# EAGLE design BrewPi Shield (EAGLE 9.4.2)
COMPANY: BrewPi Remix; ENGINEER: @LBussy; MANAGER: @Cadibrewer; REVIEW: @day_trippr; SCH_REV: 1.3.1a; WEBSITE: https://www.brewpiremix.com
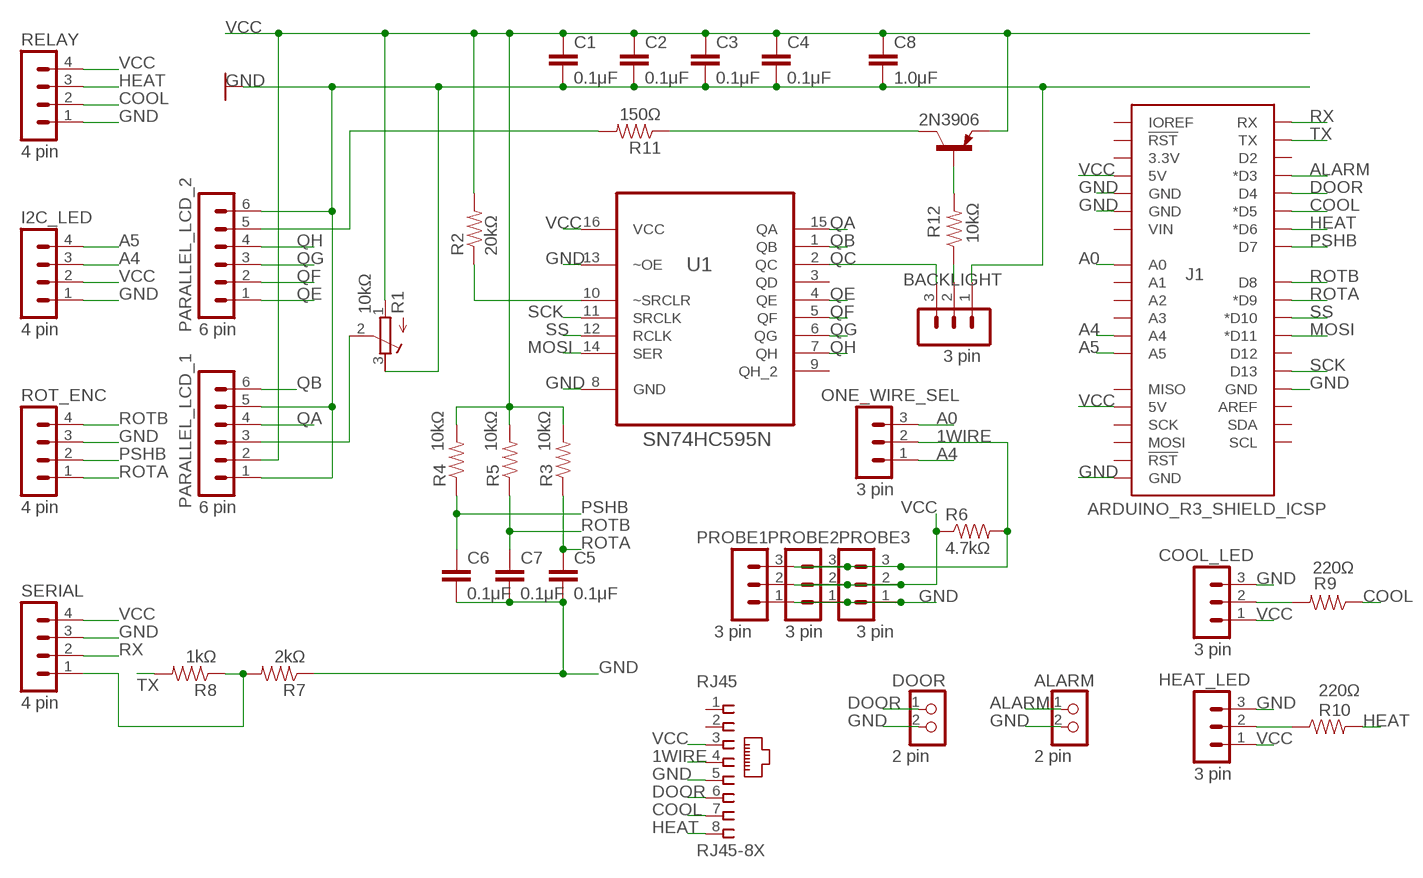
[diagram p0: schematic, sheet 1]

## Parts
ALARM  2 pin  HEADER02-1  [HEADER02-1]
BACKLIGHT  3 pin  HEADER03-1  [HEADER03-1]
C1  0.1μF  CAPKIT  [CAP-PTH-SMALL-KIT]
C2  0.1μF  CAPKIT  [CAP-PTH-SMALL-KIT]
C3  0.1μF  CAPKIT  [CAP-PTH-SMALL-KIT]
C4  0.1μF  CAPKIT  [CAP-PTH-SMALL-KIT]
C5  0.1μF  CAPKIT  [CAP-PTH-SMALL-KIT]
C6  0.1μF  CAPKIT  [CAP-PTH-SMALL-KIT]
C7  0.1μF  CAPKIT  [CAP-PTH-SMALL-KIT]
C8  1.0μF  CAPKIT  [CAP-PTH-SMALL-KIT]
COOL_LED  3 pin  HEADER03-1  [HEADER03-1]
DOOR  2 pin  HEADER02-1  [HEADER02-1]
HEAT_LED  3 pin  HEADER03-1  [HEADER03-1]
I2C_LED  4 pin  HEADER04-1  [HEADER04-1]
J1  ARDUINO_R3_SHIELD_ICSP  [UNO_R3_SHIELD_ICSP]
ONE_WIRE_SEL  3 pin  HEADER03-1  [HEADER03-1]
PARALLEL_LCD_1  6 pin  HEADER06-1  [HEADER06-1]
PARALLEL_LCD_2  6 pin  HEADER06-1  [HEADER06-1]
PROBE1  3 pin  HEADER03-1  [HEADER03-1]
PROBE2  3 pin  HEADER03-1  [HEADER03-1]
PROBE3  3 pin  HEADER03-1  [HEADER03-1]
Q1  2N3906  [TO92]
R1  10kΩ  R-TRIMM3296Y  [RTRIM3296Y]
R2  20kΩ  RESISTORAXIAL-0.3  [AXIAL-0.3]
R3  10kΩ  RESISTORAXIAL-0.3  [AXIAL-0.3]
R4  10kΩ  RESISTORAXIAL-0.3  [AXIAL-0.3]
R5  10kΩ  RESISTORAXIAL-0.3  [AXIAL-0.3]
R6  4.7kΩ  RESISTORAXIAL-0.3  [AXIAL-0.3]
R7  2kΩ  RESISTORAXIAL-0.3  [AXIAL-0.3]
R8  1kΩ  RESISTORAXIAL-0.3  [AXIAL-0.3]
R9  220Ω  RESISTORAXIAL-0.3  [AXIAL-0.3]
R10  220Ω  RESISTORAXIAL-0.3  [AXIAL-0.3]
R11  150Ω  RESISTORAXIAL-0.3  [AXIAL-0.3]
R12  10kΩ  RESISTORAXIAL-0.3  [AXIAL-0.3]
RELAY  4 pin  HEADER04-1  [HEADER04-1]
RJ45  RJ45-8X  [RJ45-NO-SHIELD]
ROT_ENC  4 pin  HEADER04-1  [HEADER04-1]
SERIAL  4 pin  HEADER04-1  [HEADER04-1]
U1  SN74HC595N  [DIP254P762X508-16]

## Nets
1WIRE: ONE_WIRE_SEL.2 PROBE1.3 PROBE2.3 PROBE3.3 R6.P$2 RJ45.4
A0: J1.A0 ONE_WIRE_SEL.3
A4: I2C_LED.3 J1.A4 ONE_WIRE_SEL.1
A5: I2C_LED.4 J1.A5
ALARM: ALARM.1 J1.D3(*D3)
COOL: J1.D5(*D5) R9.P$1 RELAY.2 RJ45.7
DOOR: DOOR.1 J1.D4 RJ45.6
GND: ALARM.2 BACKLIGHT.1 C1.2 C2.2 C3.2 C4.2 C5.2 C6.2 C7.2 C8.2 COOL_LED.3 DOOR.2 HEAT_LED.3 I2C_LED.1 J1.GND@0(GND) J1.GND@1(GND) J1.GND@2(GND) J1.GND_ICSP(GND) PARALLEL_LCD_1.1 PARALLEL_LCD_1.5 PARALLEL_LCD_2.6 PROBE1.1 PROBE2.1 PROBE3.1 R1.3(E) R7.P$1 RELAY.1 RJ45.5 ROT_ENC.3 SERIAL.3 U1.8(GND) U1.13(~OE)
HEAT: J1.D6(*D6) R10.P$2 RELAY.3 RJ45.8
MOSI: J1.D11(*D11) U1.14(SER)
N$1: R2.P$1 U1.10(~SRCLR)
N$2: BACKLIGHT.2 R12.P$1
N$3: R7.P$2 R8.P$1 SERIAL.1
N$4: COOL_LED.2 R9.P$2
N$5: PARALLEL_LCD_2.5 R11.P$2
N$6: PARALLEL_LCD_1.3 R1.2(S)
N$7: Q1.1(C) R11.P$1
N$8: HEAT_LED.2 R10.P$1
N$9: Q1.2(B) R12.P$2
PSHB: C6.1 J1.D7 R4.P$1 ROT_ENC.2
QA: PARALLEL_LCD_1.4 U1.15(QA)
QB: PARALLEL_LCD_1.6 U1.1(QB)
QC: BACKLIGHT.3 U1.2(QC)
QE: PARALLEL_LCD_2.1 U1.4(QE)
QF: PARALLEL_LCD_2.2 U1.5(QF)
QG: PARALLEL_LCD_2.3 U1.6(QG)
QH: PARALLEL_LCD_2.4 U1.7(QH)
ROTA: C5.1 J1.D9(*D9) R3.P$1 ROT_ENC.1
ROTB: C7.1 J1.D8 R5.P$1 ROT_ENC.4
RX: J1.RX SERIAL.2
SCK: J1.D13 U1.11(SRCLK)
SS: J1.D10(*D10) U1.12(RCLK)
TX: J1.TX R8.P$2
VCC: C1.1 C2.1 C3.1 C4.1 C8.1 COOL_LED.1 HEAT_LED.1 I2C_LED.2 J1.5V J1.5V_ICSP(5V) PARALLEL_LCD_1.2 PROBE1.2 PROBE2.2 PROBE3.2 Q1.3(E) R1.1(A) R2.P$2 R3.P$2 R4.P$2 R5.P$2 R6.P$1 RELAY.4 RJ45.3 SERIAL.4 U1.16(VCC)
Unconnected: J1.3.3V J1.A1 J1.A2 J1.A3 J1.AREF J1.D2 J1.D12 J1.IOREF J1.MISO J1.MOSI J1.RES(!RST!) J1.RST_ICSP(!RST!) J1.SCK J1.SCL J1.SDA J1.VIN RJ45.1 RJ45.2 U1.3(QD) U1.9(QH_2)

## Library data of the parts
ALARM DOOR = LBussy:HEADER02-1: PIN HEADER
BACKLIGHT COOL_LED HEAT_LED ONE_WIRE_SEL PROBE1-PROBE3 = LBussy:HEADER03-1: PIN HEADER; OC_FARNELL: unknown; OC_NEWARK: unknown
C1-C8 = SparkFun-Capacitors:CAP: Capacitor Standard 0603 ceramic capacitor, and 0.1" leaded capacitor.
I2C_LED RELAY ROT_ENC SERIAL = LBussy:HEADER04-1: PIN HEADER; OC_FARNELL: unknown; OC_NEWARK: unknown
J1 = SparkFun-Boards:ARDUINO_R3_SHIELD_ICSP: Arduino R3 Shield Footprint w/ 6-pin (2x3) ICSP Header
PARALLEL_LCD_1 PARALLEL_LCD_2 = LBussy:HEADER06-1: PIN HEADER; OC_FARNELL: unknown; OC_NEWARK: unknown
Q1 = transistor-pnp:2N3906: PNP Transistor
R1 = rcl:R-TRIMM: Trimm resistor; SPICEMODEL: X; SPICEPREFIXL: POT
R2-R12 = SparkFun-Passives:RESISTOR: Resistor Basic schematic elements and footprints for 0603, 1206, and PTH resistors.
RJ45 = con-tycoelectronics:RJ45: CORCOM Modular RJ Jacks No Shield Source: www.tycoelectronics.com .. ENG_DS_1654001_1099_RJ_L_0507.pdf; MPN: RJ45-8X; OC_FARNELL: unknown; OC_NEWARK: 16R6101
U1 = Texas Instruments_By_element14_Batch_1:SN74HC595N: 8-BIT SHIFT REGISTERS WITH 3-STATE OUTPUT REGISTERS; MPN: SN74HC595N; OC_FARNELL: 9591664; OC_NEWARK: 60K6845; PACKAGE: PDIP-16; SUPPLIER: Texas Instruments

## Board
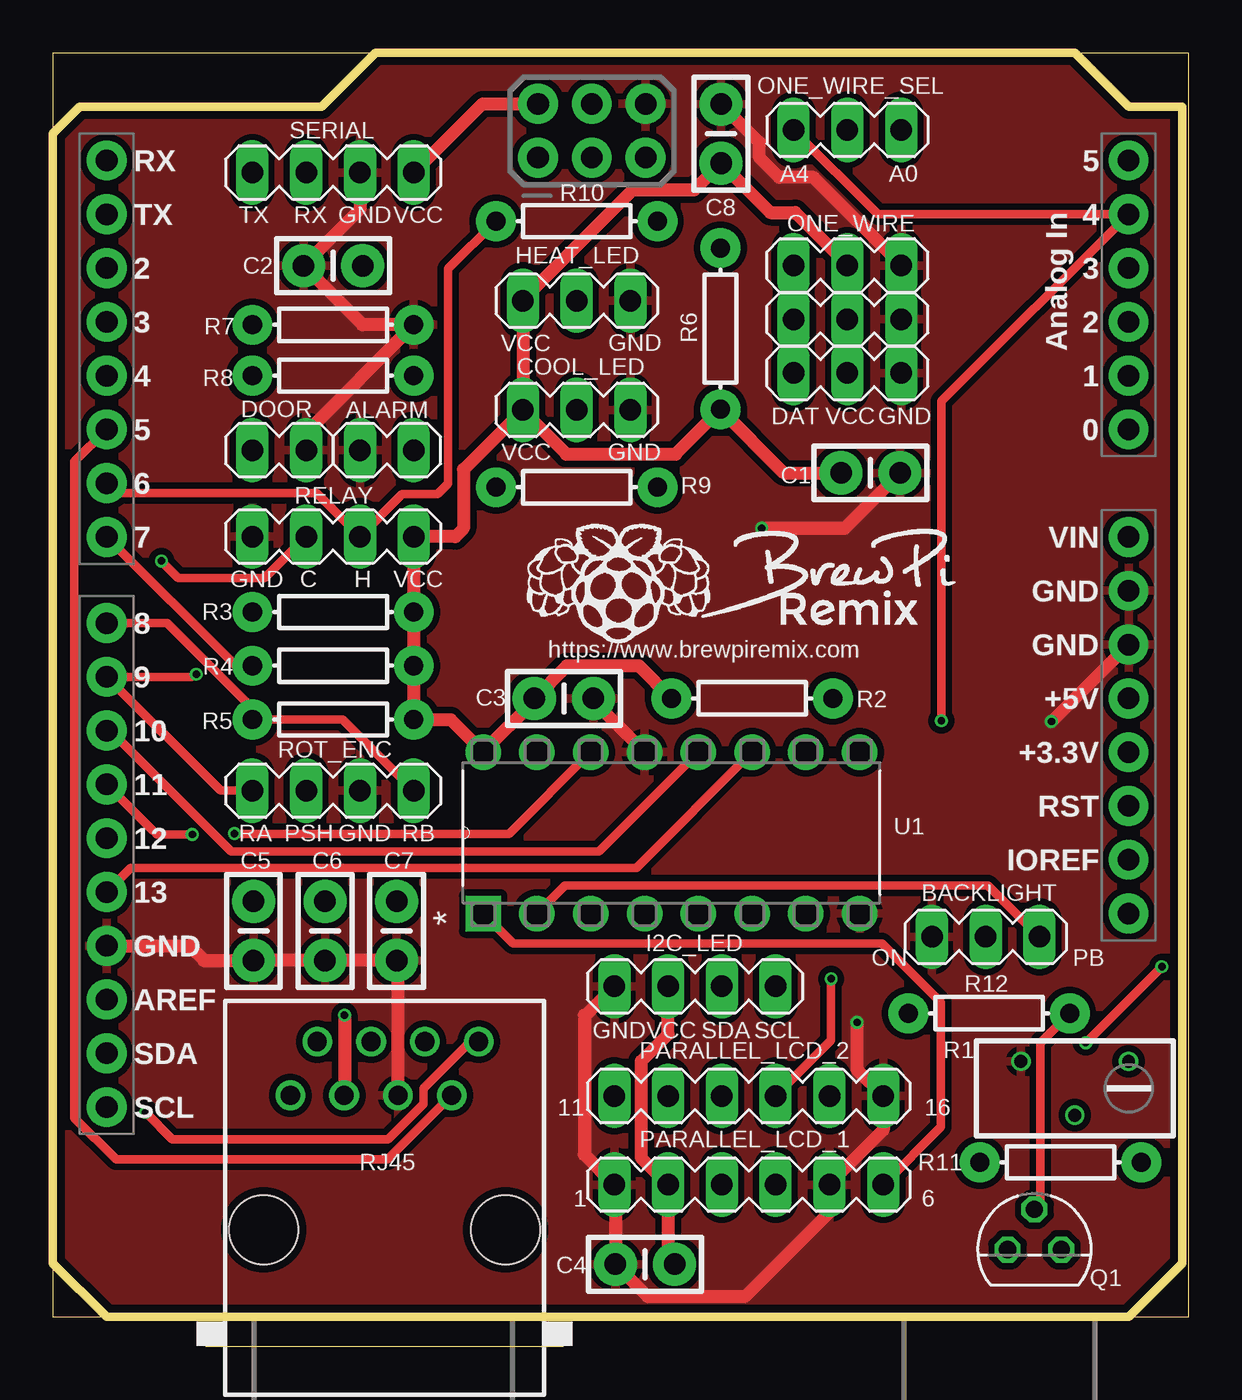
[diagram p1: board, top side]
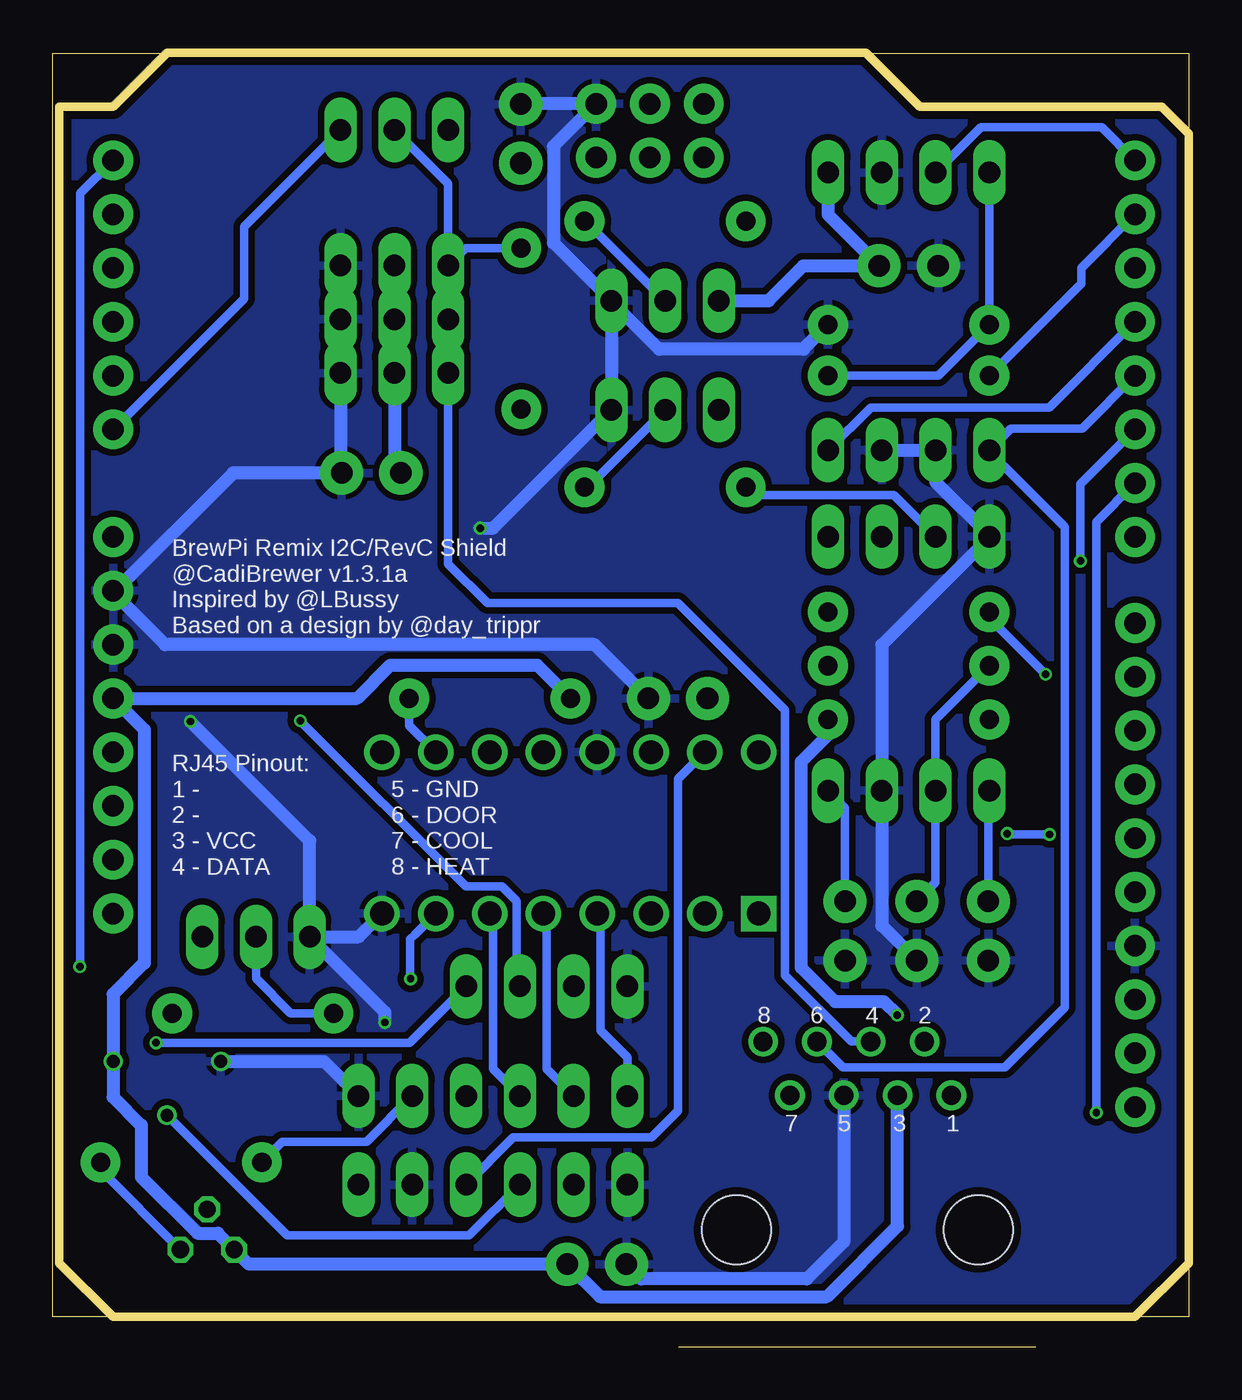
[diagram p2: board, bottom side, seen from below]

Size 53.65 x 59.69 mm. Coordinates in mm from the lower left corner, seen from the top.
Outline: 0,0 53.65,0 53.65,59.68 0,59.68 0,0
Outline: 0,2.54 0,55.88 1.27,57.15 12.7,57.15 15.24,59.69 48.26,59.69 50.8,57.15 53.34,57.15 53.34,2.54 50.8,0 2.54,0 0,2.54
Copper layers (1*16): Top 0.035559375mm / dielectric 1.6mm / Bottom 0.035559375mm
Design rules "oshpark-2layer *": minimum track width 6mil, minimum drill 10mil, track to track 8mil, track to pad 8mil, pad to pad 8mil, via to via 8mil, smd to smd 8mil, copper to edge 15mil, drill to drill 6mil, minimum pad ring 5mil, minimum via ring 5mil, stop-mask expansion 0mil, vias tented up to drill 3.5mm, thermal gap 10mil

### Footprints (pad centres in the part's own frame; a part is rotated, then mirrored left to right if it is on the bottom)
HEADER02-1 = drill 1.016 long: 1 -1.27,0; 2 1.27,0
HEADER03-1 = drill 1.016 long: 1 -2.54,0; 2 0,0; 3 2.54,0
CAP-PTH-SMALL-KIT = drill 1.016 pad 2.032: 1 -1.397,0; 2 1.397,0
HEADER04-1 = drill 1.016 long: 1 -3.81,0; 2 -1.27,0; 3 1.27,0; 4 3.81,0
UNO_R3_SHIELD_ICSP = drill 1.016 pad 1.88: 3.3V 50.8,26.67; 5V 50.8,29.21; 5V_ICSP 22.91,57.29; A0 50.8,41.91; A1 50.8,44.45; A2 50.8,46.99; A3 50.8,49.53; A4 50.8,52.07; A5 50.8,54.61; AREF 2.54,14.986; D2 2.54,49.53; D3 2.54,46.99; D4 2.54,44.45; D5 2.54,41.91; D6 2.54,39.37; D7 2.54,36.83; D8 2.54,32.766; D9 2.54,30.226; D10 2.54,27.686; D11 2.54,25.146; D12 2.54,22.606; D13 2.54,20.066; GND@0 50.8,31.75; GND@1 50.8,34.29; GND@2 2.54,17.526; GND_ICSP 27.99,57.29; IOREF 50.8,21.59; MISO 22.91,54.75; MOSI 25.45,57.29; NC 50.8,19.05; RES 50.8,24.13; RST_ICSP 27.99,54.75; RX 2.54,54.61; SCK 25.45,54.75; SCL 2.54,9.906; SDA 2.54,12.446; TX 2.54,52.07; VIN 50.8,36.83
HEADER06-1 = drill 1.016 long: 1 -6.35,0; 2 -3.81,0; 3 -1.27,0; 4 1.27,0; 5 3.81,0; 6 6.35,0
TO92 = drill 0.813 octagon: 1 1.27,0; 2 0,1.905; 3 -1.27,0
RTRIM3296Y = drill 0.61: 1 1.27,-2.54; 2 -1.27,0; 3 1.27,2.54
AXIAL-0.3 = drill 0.9 pad 1.88: P$1 -3.81,0; P$2 3.81,0
RJ45-NO-SHIELD = drill 0.9 pad 1.4: 1 -4.445,6.35; 2 -3.175,8.89; 3 -1.905,6.35; 4 -0.635,8.89; 5 0.635,6.35; 6 1.905,8.89; 7 3.175,6.35; 8 4.445,8.89 | hole 3.251: -5.715,0; 5.715,0
DIP254P762X508-16 = drill 1.118 square: 1 -7.62,17.78 | drill 1.118: 2 -7.62,15.24; 3 -7.62,12.7; 4 -7.62,10.16; 5 -7.62,7.62; 6 -7.62,5.08; 7 -7.62,2.54; 8 -7.62,0; 9 0,0; 10 0,2.54; 11 0,5.08; 12 0,7.62; 13 0,10.16; 14 0,12.7; 15 0,15.24; 16 0,17.78

### Placement (x,y rotation side)
ALARM  15.77,40.93 180 top
BACKLIGHT  44.06,17.95 0 top
C1  38.61,39.86 0 top
C2  13.23,49.64 180 top
C3  24.13,29.21 0 top
C4  27.96,2.49 180 top
C5  9.47,18.23 270 top
C6  12.85,18.23 270 top
C7  16.23,18.23 270 top
C8  31.55,55.88 90 top
COOL_LED  24.74,42.83 0 top
DOOR  10.69,40.93 0 top
HEAT_LED  24.74,47.99 0 top
I2C_LED  30.32,15.61 0 top
J1  0,0 0 top
ONE_WIRE_SEL  37.52,56.05 0 top
PARALLEL_LCD_1  32.86,6.25 0 top
PARALLEL_LCD_2  32.86,10.43 0 top
PROBE1  37.52,49.65 180 top
PROBE2  37.52,47.11 180 top
PROBE3  37.52,44.57 180 top
Q1  46.36,3.18 0 top
R1  48.26,10.79 90 top
R2  33.02,29.21 180 top
R3  13.23,33.29 0 top
R4  13.23,30.75 0 top
R5  13.23,28.21 0 top
R6  31.53,46.67 90 top
R7  13.23,46.85 180 top
R8  13.23,44.45 180 top
R9  24.74,39.18 0 top
R10  24.74,51.75 180 top
R11  47.59,7.3 180 top
R12  44.21,14.34 0 top
RELAY  13.23,36.85 0 top
RJ45  15.66,4.11 0 top
ROT_ENC  13.23,24.85 0 top
SERIAL  13.23,54.04 0 top
U1  38.1,26.67 90 top

### Tracks (layer width: path | path; a pad name or v marks a point on that pad's centre or on a via)
1WIRE
  Bottom 0.406: RJ45.4 15.94,13 19.07,16.13 19.07,28.65 24.13,33.71 33.13,33.71 34.98,35.56 PROBE3.3 PROBE2.3 PROBE1.3 | R6.P$2 34.15,50.48 PROBE1.3 | ONE_WIRE_SEL.2 34.98,53.51 PROBE1.3
A0
  Bottom 0.406: ONE_WIRE_SEL.3 44.62,51.49 44.62,48.09 J1.A0
A4  (via drill 0.35)
  Top 0.406: ONE_WIRE_SEL.1 38.96,52.07 J1.A4 41.97,43.24 v41.97,28.16 v41.96,28.15
  Bottom 0.406: v41.96,28.15 34.13,20.32 32.43,20.32 31.75,19.64 31.75,15.76 I2C_LED.3
A5  (via drill 0.35)
  Top 0.152: v52.37,16.54 v52.38,16.54
  Top 0.406: v48.78,12.95 v52.37,16.54
  Bottom 0.152: v52.38,16.54 52.35,16.56
  Bottom 0.406: J1.A5 52.35,53.06 52.35,17.93 52.35,16.56 | v48.78,12.95 36.8,12.95 I2C_LED.4
ALARM
  Bottom 0.406: J1.D3 6.58,42.95 15.02,42.95 ALARM.1
COOL  (via drill 0.35)
  Top 0.406: v5.12,35.7 5.92,34.9 10.01,34.9 RELAY.2 | RJ45.7 15.8,7.43 3,7.43 1.02,9.41 1.02,40.39 J1.D5
  Bottom 0.406: R9.P$1 20.55,38.81 13.92,38.81 RELAY.2 | J1.D5 5.12,39.33 v5.12,35.7
DOOR
  Bottom 0.406: RJ45.6 16.34,11.77 8.7,11.77 5.86,14.61 5.86,37.29 9.42,40.85 DOOR.1 8.4,41.95 5.04,41.95 J1.D4
GND  (via drill 0.35)
  Top 0.152: 25.15,14.25 25.1,14.25 | PARALLEL_LCD_1.1 26.56,6.2 | v47.16,28.12 v47.17,28.12
  Top 0.61: SERIAL.3 14.5,52.31 C2.2 14.62,46.85 R7.P$1 11.96,41.77 DOOR.2 | J1.GND@2 6.44,17.53 7.13,16.83 C5.2 C6.2 C7.2 16.29,16.77 RJ45.5 | PROBE1.1 40.06,49.69 35.93,53.82 34.3,53.82 33.37,54.75 33.37,55.46 C8.2 | v33.47,37.25 37.4,37.25 C1.2 | U1.13 25.53,29.08 C3.2 | I2C_LED.1 25.15,14.25 | 25.1,14.25 25.1,7.66 PARALLEL_LCD_1.1 | 26.56,6.2 C4.2 28.1,0.95 32.68,0.95 36.67,4.95 PARALLEL_LCD_1.5 36.67,6.29 39.21,8.83 PARALLEL_LCD_2.6 37.97,11.67 v37.97,13.91 | J1.GND@0 v47.17,28.12
  Bottom 0.152: R7.P$1 | 47.12,28.08 v47.16,28.12
  Bottom 0.61: 50.8,34.2 J1.GND@1 | PARALLEL_LCD_2.6 40.84,12.06 R1.3 | 50.8,34.2 45.14,39.86 C1.2 40.06,39.91 PROBE3.1 PROBE2.1 PROBE1.1 | ALARM.2 DOOR.2 11.96,39.43 9.42,36.89 RELAY.1 9.42,36.81 14.5,31.73 ROT_ENC.3 14.5,18.48 C6.2 | COOL_LED.3 | COOL_LED.3 32.87,37.25 v33.47,37.25 | HEAT_LED.3 30,50.72 30,55.28 J1.GND_ICSP 31.54,57.29 C8.2 | HEAT_LED.3 27.28,42.84 COOL_LED.3 | C3.2 28.07,31.75 48.35,31.75 50.8,34.2 | BACKLIGHT.1 39.2,17.94 U1.8 | R7.P$1 18.19,45.69 25.01,45.69 27.28,47.95 HEAT_LED.3 | BACKLIGHT.1 41.52,22.48 47.12,28.08 | RJ45.5 16.29,3.54 18.05,1.79 25.86,1.79 C4.2 | BACKLIGHT.1 37.97,14.4 v37.97,13.91
  pour Top (isolate 0.305): 0,2.54 0,55.88 1.27,57.15 12.7,57.15 15.24,59.69 48.26,59.69 50.8,57.15 53.34,57.15 53.34,2.54 50.8,0 2.54,0
  pour Bottom (isolate 0.305): 0,2.54 0,55.88 1.27,57.15 12.7,57.15 15.24,59.69 48.26,59.69 50.8,57.15 53.34,57.15 53.34,2.54 50.8,0 2.54,0
HEAT  (via drill 0.35)
  Top 0.406: J1.D6 3.01,38.9 12.45,38.9 RELAY.3 16.5,38.85 18.17,38.85 18.67,39.35 18.67,49.5 R10.P$2 | v4.37,9.65 5.64,8.38 15.84,8.38 17.51,10.06 17.51,10.78 19.73,13 RJ45.8
  Bottom 0.406: J1.D6 4.37,37.54 v4.37,9.65
MOSI  (via drill 0.35)
  Top 0.152: 4.77,22.91 4.74,22.95 | 8.59,22.81 v8.57,22.82
  Top 0.406: J1.D11 4.74,22.95 | U1.14 21.54,22.81 8.59,22.81 | 4.77,22.91 4.9,22.78 v6.58,22.78
  Bottom 0.152: 8.56,22.78 8.57,22.8 v8.57,22.82
  Bottom 0.406: v6.58,22.78 8.56,22.78
N$1
  Bottom 0.406: R2.P$1 36.83,27.94 U1.10
N$2
  Bottom 0.406: R12.P$1 42.42,14.34 44.06,15.98 BACKLIGHT.2
N$3
  Bottom 0.406: SERIAL.1 R7.P$2 11.82,44.45 R8.P$1
N$4
  Bottom 0.406: COOL_LED.2 28.39,39.18 R9.P$2
N$5
  Bottom 0.406: PARALLEL_LCD_2.5 38.84,8.27 42.81,8.27 R11.P$2
N$6
  Bottom 0.406: R1.2 42.58,3.85 33.99,3.85 PARALLEL_LCD_1.3
N$7
  Bottom 0.406: R11.P$1 51.4,6.95 Q1.1
N$8
  Bottom 0.406: R10.P$1 28.5,51.75 HEAT_LED.2
N$9
  Top 0.406: Q1.2 46.62,5.35 46.62,12.65 46.62,12.94 R12.P$2
PSHB
  Top 0.406: R4.P$1 8.62,30.75 J1.D7
  Bottom 0.406: C6.1 11.96,20.52 ROT_ENC.2 11.96,28.21 R4.P$1
QA
  Bottom 0.406: U1.15 24.13,25.4 24.13,9.73 25.38,8.47 31.91,8.47 PARALLEL_LCD_1.4
QB
  Top 0.406: PARALLEL_LCD_1.6 41.94,8.97 41.94,14.86 39.15,17.65 21.72,17.65 U1.1
QC
  Top 0.406: U1.2 24.19,20.38 38.12,20.38 44.16,20.38 BACKLIGHT.3
QE
  Bottom 0.406: PARALLEL_LCD_2.1 26.51,12.25 27.79,13.53 27.79,18.9 U1.4
QF
  Bottom 0.406: U1.5 30.33,18.9 30.33,11.71 PARALLEL_LCD_2.2
QG
  Bottom 0.406: U1.6 32.87,18.9 32.87,11.71 PARALLEL_LCD_2.3
QH  (via drill 0.35)
  Top 0.406: PARALLEL_LCD_2.4 36.75,13.05 v36.75,15.96
  Bottom 0.152: 36.77,15.98 v36.75,15.96
  Bottom 0.406: U1.7 36.56,18.05 36.57,18.05 36.77,17.85 36.77,15.98
ROTA  (via drill 0.35)
  Top 0.406: ROT_ENC.1 7.92,24.85 J1.D9 6.55,30.23 6.67,30.35 v6.77,30.35
  Bottom 0.406: ROT_ENC.1 9.47,24.8 C5.1 | v6.77,30.35 9.42,33 R3.P$1
ROTB
  Top 0.406: ROT_ENC.4 13.68,28.21 R5.P$1 9.42,28.75 5.4,32.77 J1.D8
  Bottom 0.406: ROT_ENC.4 16.23,24.04 C7.1
RX
  Bottom 0.406: J1.RX 4.12,56.19 9.81,56.19 SERIAL.2
SCK
  Top 0.406: J1.D13 3.68,21.21 27.56,21.21 U1.11
SS
  Top 0.406: J1.D10 2.71,27.69 8.42,21.97 25.79,21.97 U1.12
TX
  Bottom 0.406: J1.TX 5.08,49.53 5.08,48.79 R8.P$2
VCC  (via drill 0.35)
  Top 0.61: COOL_LED.1 HEAT_LED.1 22.2,48.03 27.39,53.23 30.29,53.23 C8.1 33.88,52.15 35.06,52.15 37.52,49.69 PROBE1.2 | R2.P$2 27.67,30.75 24.27,30.75 C3.1 22.73,29.08 U1.16 18.78,28.21 R5.P$2 R4.P$2 R3.P$2 RELAY.4 19.01,36.85 19.39,37.23 19.39,40.03 COOL_LED.1 | COOL_LED.1 22.2,42.79 24.25,40.73 29.4,40.73 R6.P$1 34.53,39.86 C1.1 | I2C_LED.2 29.05,13.34 27.78,12.07 27.78,7.52 PARALLEL_LCD_1.2 29.05,2.79 C4.1 | SERIAL.4 20.29,57.29 J1.5V_ICSP | RJ45.3 13.77,10.47 v13.77,14.25
  Bottom 0.61: R2.P$2 30.78,30.78 37.71,30.78 39.28,29.21 J1.5V 49.33,27.74 49.33,16.71 50.8,15.24 R1.1 50.8,10.38 49.47,9.05 49.47,6.6 46.82,3.95 45.86,3.95 Q1.3 44.4,2.49 C4.1 27.82,0.95 17.09,0.95 13.75,4.29 RJ45.3 | SERIAL.4 17.04,52.05 C2.1 18.2,49.64 19.85,47.99 HEAT_LED.1 | PROBE1.2 PROBE2.2 PROBE3.2 37.52,40.17 C1.1 | R5.P$2 17.04,27.49 18.31,26.21 18.31,16.5 16.71,14.9 14.42,14.9 v13.77,14.25

### Text on the board
tNames: A4 | A0 | TX | RX | GND | VCC | C8 | ONE_WIRE | C2 | VCC | GND | DAT | VCC | GND | VCC | GND | C1 | GND | C | H | VCC | https://www.brewpiremix.com | C3 | RA | PSH | GND | RB | C5 | C6 | C7 | ON | PB | GND | VCC | SDA | SCL | R1 | 11 | 16 | 1 | 6 | C4 | Q1
bNames: BrewPi Remix I2C/RevC Shield / @CadiBrewer v1.3.1a / Inspired by @LBussy / Based on a design by @day_trippr | 5 - GND / 6 - DOOR / 7 - COOL / 8 - HEAT | RJ45 Pinout: / 1 - / 2 - / 3 - VCC / 4 - DATA | 2 | 4 | 6 | 8 | 1 | 3 | 5 | 7